# Altium schematic sheet PowerSupplies.SchDoc
size A4
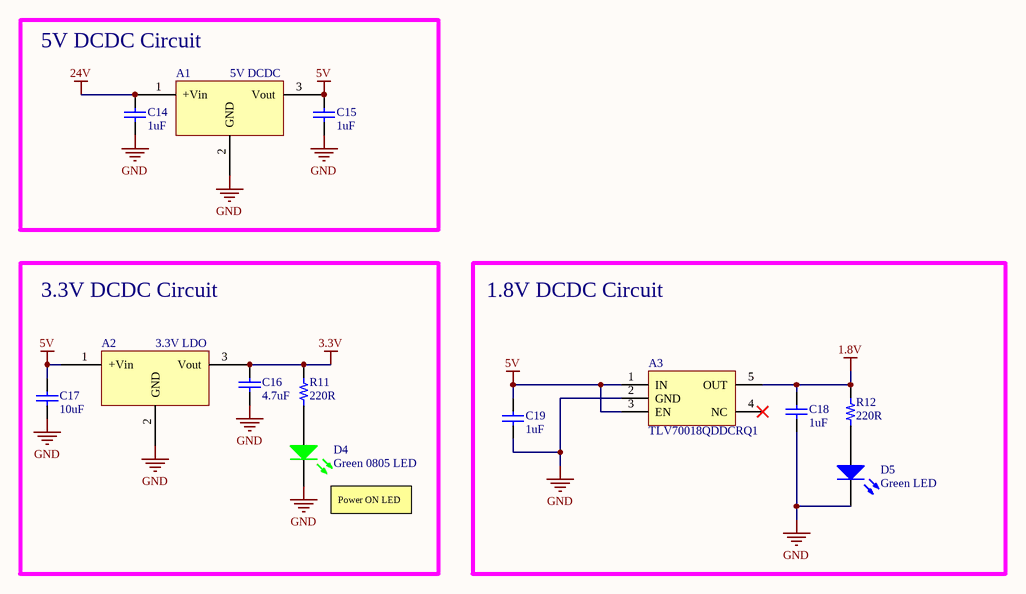
[diagram p0: PowerSupplies.SchDoc]

## Parts
A1  5V DCDC  [R-78E-0.5]
A2  3.3V LDO  [TO252-3]
A3  TLV70018QDDCRQ1  [SOT-23-5]
C14  value 1uF  [C0603]  (hidden comment: CAP CER 0603 1uF 25V X7R 20%)
C15  value 1uF  [C0603]  (hidden comment: CAP CER 0603 1uF 25V X7R 20%)
C16  value 4.7uF  [C0603]  (hidden comment: CAP CER 0603 4.7uF 25V X7R 10%)
C17  value 10uF  [C0603]  (hidden comment: CAP CER 0603 10uF 6.3V X5R 20%)
C18  value 1uF  [C0603]  (hidden comment: CAP CER 0603 1uF 16V X7R 10%)
C19  value 1uF  [C0603]  (hidden comment: CAP CER 0603 1uF 16V X7R 10%)
D4  Green 0805 LED  [LED0805]
D5  Green LED  [LED0603]
R11  value 220R  [R0603]  (hidden comment: RES 0603 220R 5% 0.25W)
R12  value 220R  [R0603]  (hidden comment: RES 0603 220R 5% 0.25W)

## Blocks framed on the sheet
5V DCDC Circuit: A1 C14 C15
3.3V DCDC Circuit: A2 C16 C17 D4 R11
1.8V DCDC Circuit: A3 C18 C19 D5 R12

## Nets
1.8V: A3.5(OUT) C18.2 R12.2
3.3V: A2.3(Vout) C16.2 R11.2
5V: A1.3(Vout) A2.1(+Vin) A3.1(IN) A3.3(EN) C15.2 C17.2 C19.2
24V: A1.1(+Vin) C14.2
GND: A1.2(GND) A2.2(GND) A3.2(GND) C14.1 C15.1 C16.1 C17.1 C18.1 C19.1 D4.1(K) D5.1(K)
NetD4_2: D4.2(A) R11.1
NetD5_2: D5.2(A) R12.1

Not connected (* = marked no-connect by the designer): A3 4(NC)*

## Notes on the sheet
- (near D4) Power ON LED

## Library data of the parts
A1 = R78E5.0-0.5: Manufacturer: Recom; Part_Number: R-78E5.0-0.5; Vin: 7-28V; Iout: 500mA; Efficiency: 82-92%; Supplier_Link: http://www.digikey.ca/product-detail/en/R-78E5.0-0.5/945-1648-5-ND/2834904; Vout: 5V; Price: 4.04; Price_10: 3.972
A2 = NCV5501DT33RKG: Linear Voltage Regulator IC Positive Fixed 1 Output 3.3V 500mA DPAK-3; Manufacturer: ON Semiconductor; Iout: 500 mA; Price: 1.33; Price_10: 1.194; Supplier 1: Digi-Key; Supplier_Link: http://www.digikey.ca/product-detail/en/on-semiconductor/NCV5501DT33RKG/NCV5501DT33RKGOSCT-ND/3462418; Supplier Part Number 1: NCV5501DT33RKGOSCT-ND; Vout: 3.3V; Part_Number: NCV5501DT33RKG
A3 = TLV70018QDDCRQ1: Linear Voltage Regulator IC Positive Fixed 1 Output 1.8V 300mA SOT-23-5; Manufacturer: Texas Instruments; Part_Number: TLV70018QDDCRQ1; Supplier_Link: https://www.digikey.ca/product-detail/en/texas-instruments/TLV70018QDDCRQ1/296-36761-1-ND/4341463
C14 C15 = CAP CER 0603 1uF 25V X7R 20%: 1uF ceramic capacitor; Manufacturer: TDK Corporation; Part_Number: CGA3E1X7R1E105M080AC; Supplier_Link: http://www.digikey.ca/product-detail/en/CGA3E1X7R1E105M080AC/445-12548-1-ND/3954214; Tolerance: 20%; Voltage rating: 25V; Price: 0.24; Price_10: 0.171
C16 = CAP CER 0603 4.7uF 25V X7R 10%: 4.7uF ceramic capacitor; Manufacturer: Kernet; Part_Number: C1206C475K3RACAUTO; Supplier_Link: http://www.digikey.ca/product-detail/en/CGA3E3X7R1E474K080AB/445-6929-1-ND/2672947; Tolerance: 10%; Voltage rating: 25V; Price: 0.48; Supplier 1: Digi-Key; Supplier Part Number 1: 399-7029-1-ND; Price_10: 0.428
C17 = CAP CER 0603 10uF 6.3V X5R 20%: 10uF ceramic capacitor; Manufacturer: Taiyo Yuden; Part_Number: JMK107ABJ106MAHT; Supplier_Link: http://www.digikey.ca/product-detail/en/JMK107ABJ106MAHT/587-3383-1-ND/4157249; Tolerance: 20%; Voltage rating: 6.3V; Price: 0.30; Supplier 1: Digi-Key; Supplier Part Number 1: 587-3383-1-ND; Price_10: 0.205
C18 C19 = CAP CER 0603 1uF 16V X7R 10%: 1uF ceramic capacitor; Manufacturer: Samsung Electro-Mechanics; Part_Number: CL10B105KO8VPNC; Supplier_Link: https://www.digikey.ca/product-detail/en/samsung-electro-mechanics/CL10B105KO8VPNC/1276-6613-1-ND/5961472; Tolerance: 10%; Voltage rating: 16V; Price: 0.32; Supplier 1: Digi-Key; Supplier Part Number 1: 1276-6613-1-ND
D4 = APT2012LZGCK: Green 525nm LED Indication - Discrete 2.65V 0805 (2012 Metric); Manufacturer: Kingbright; Forward_Voltage: 2.65; Supplier_Link: http://www.digikey.ca/product-detail/en/kingbright/APT2012LZGCK/754-1939-1-ND/5177469; Price: 0.86; Price_10: 0.673; Part_Number: APT2012LZGCK; Supplier 1: Digi-Key; Supplier Part Number 1: 754-1939-1-ND
D5 = 150060VS75000: Green LED 0603, 2V, 20mA; Manufacturer: Wurth Electronics; Supplier_Link: http://www.digikey.ca/product-detail/en/wurth-electronics-inc/150060VS75000/732-4980-1-ND/4489904; Price: 0.34; Price_10: 0.3968; Part_Number: 150060VS75000
R11 R12 = RES 0603 220R 5% 0.25W: 220 Ohms 0.25W Resistor; Part_Number: ESR03EZPJ221; Manufacturer: Rohm Semiconductor; Price: 0.15; Supplier_Link: http://www.digikey.ca/product-detail/en/ESR03EZPJ221/RHM220DCT-ND/1983788; Power: 0.25W; Supplier 1: Digi-Key; Supplier Part Number 1: RHM220DCT-ND; Tolerance: 5%
  R11: Price_10: 0.12